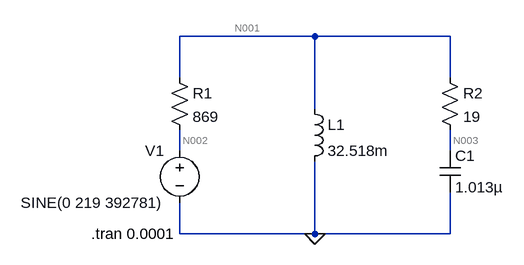
[diagram p0: schematic Var31.asc]
Var31.asc, the LTspice schematic file:
Version 4
SHEET 1 880 680
WIRE 192 -432 -16 -432
WIRE 400 -432 192 -432
WIRE -16 -368 -16 -432
WIRE 400 -368 400 -432
WIRE 192 -320 192 -432
WIRE -16 -256 -16 -288
WIRE 400 -256 400 -288
WIRE -16 -128 -16 -176
WIRE 192 -128 192 -240
WIRE 192 -128 -16 -128
WIRE 400 -128 400 -192
WIRE 400 -128 192 -128
FLAG 192 -128 0
SYMBOL voltage -16 -272 M0
WINDOW 123 0 0 Left 0
WINDOW 39 0 0 Left 0
SYMATTR InstName V1
SYMATTR Value SINE(0 219 392781)
SYMBOL res -32 -384 R0
SYMATTR InstName R1
SYMATTR Value 869
SYMBOL ind 176 -336 R0
SYMATTR InstName L1
SYMATTR Value 32.518m
SYMATTR SpiceLine Rser=31
SYMBOL res 384 -384 R0
SYMATTR InstName R2
SYMATTR Value 19
SYMBOL cap 384 -256 R0
SYMATTR InstName C1
SYMATTR Value 1.013µ
TEXT -152 -128 Left 2 !.tran 0.0001

The netlist it stands for:
* Var31.asc
V1 N002 0 SINE(0 219 392781)
R1 N001 N002 869
L1 N001 0 32.518m Rser=31
R2 N001 N003 19
C1 N003 0 1.013µ
.tran 0.0001
.backanno
.end

* Results of the author's LTspice run, read from the files saved beside the schematic
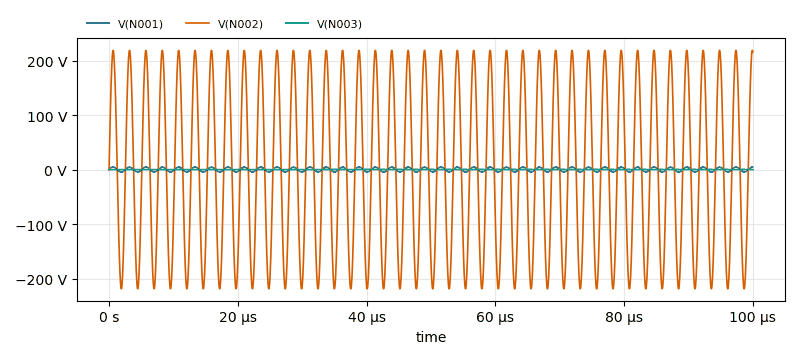
[diagram p1: Transient Analysis of Var31.asc, plotted from the saved traces]
* Transient Analysis, 1 run:
*   V(N001): min -4.595 V, max 4.754 V, average 102.7 mV, rms 3.286 V, last 4.694 V
*   V(N002): min -218.8 V, max 218.8 V, average 1.04 V, rms 155.1 V, last 215.6 V
*   V(N003): min -25.28 mV, max 194.6 mV, average 85.85 mV, rms 110.1 mV, last 88.35 mV